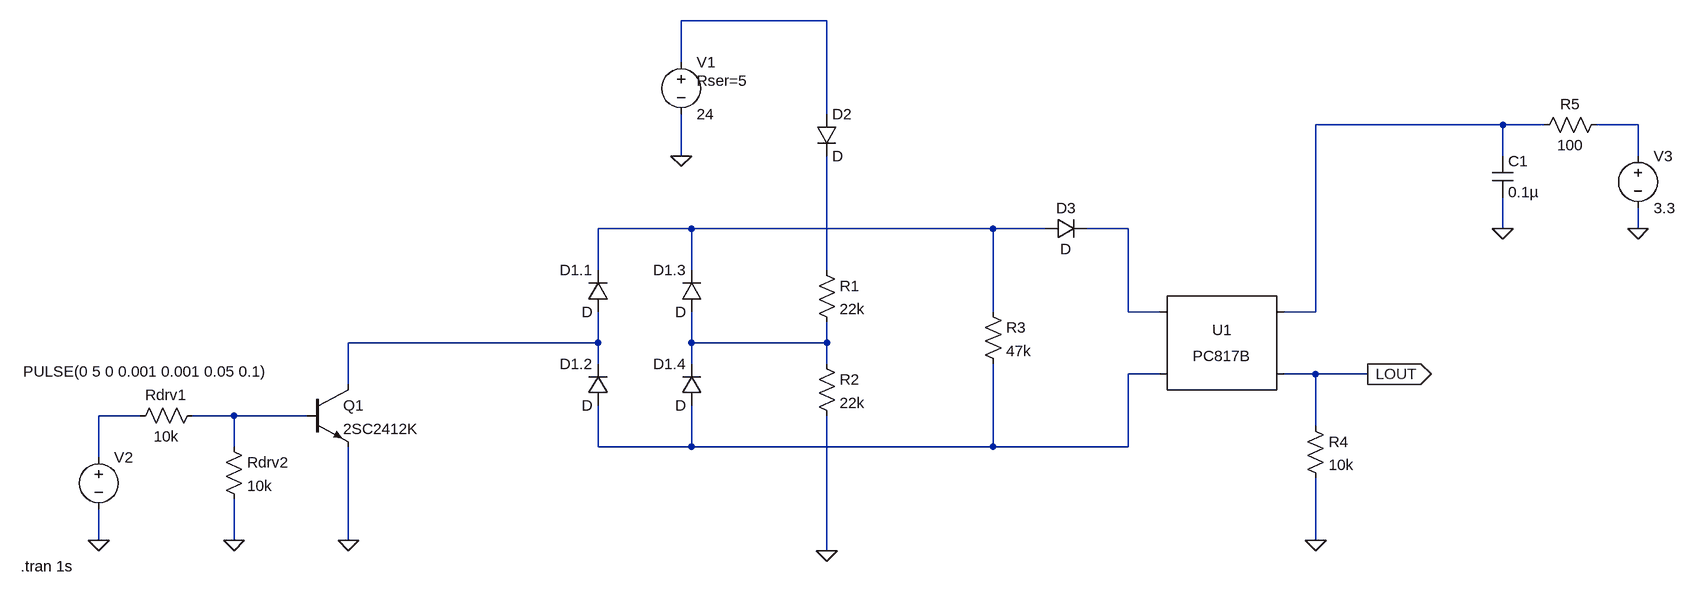
[diagram p0: schematic SensorIO.asc]
SensorIO.asc, the LTspice schematic file:
Version 4
SHEET 1 1640 680
WIRE 192 -304 -32 -304
WIRE -32 -240 -32 -304
WIRE 192 -160 192 -304
WIRE 1232 -144 944 -144
WIRE 1296 -144 1232 -144
WIRE 1440 -144 1376 -144
WIRE -32 -96 -32 -160
WIRE 1232 -96 1232 -144
WIRE 1440 -96 1440 -144
WIRE -16 16 -160 16
WIRE 448 16 -16 16
WIRE 528 16 448 16
WIRE 656 16 592 16
WIRE 1232 16 1232 -32
WIRE 1440 16 1440 -16
WIRE -160 80 -160 16
WIRE -16 80 -16 16
WIRE 192 80 192 -96
WIRE 448 144 448 16
WIRE 656 144 656 16
WIRE 704 144 656 144
WIRE 944 144 944 -144
WIRE 944 144 896 144
WIRE -160 192 -160 144
WIRE -160 192 -544 192
WIRE -16 192 -16 144
WIRE 192 192 192 160
WIRE 192 192 -16 192
WIRE -160 224 -160 192
WIRE -16 224 -16 192
WIRE 192 224 192 192
WIRE 704 240 656 240
WIRE 944 240 896 240
WIRE 1024 240 944 240
WIRE -544 256 -544 192
WIRE -864 304 -928 304
WIRE -720 304 -784 304
WIRE -608 304 -720 304
WIRE 944 320 944 240
WIRE -720 352 -720 304
WIRE -160 352 -160 288
WIRE -16 352 -16 288
WIRE -16 352 -160 352
WIRE 448 352 448 224
WIRE 448 352 -16 352
WIRE 656 352 656 240
WIRE 656 352 448 352
WIRE -928 368 -928 304
WIRE -928 496 -928 448
WIRE -720 496 -720 432
WIRE -544 496 -544 352
WIRE 944 496 944 400
WIRE 192 512 192 304
FLAG 192 512 0
FLAG -32 -96 0
FLAG -928 496 0
FLAG 1440 16 0
FLAG 944 496 0
FLAG -720 496 0
FLAG -544 496 0
FLAG 1232 16 0
FLAG 1024 240 LOUT
IOPIN 1024 240 Out
SYMBOL res 176 64 R0
SYMATTR InstName R1
SYMATTR Value 22k
SYMBOL res 176 208 R0
SYMATTR InstName R2
SYMATTR Value 22k
SYMBOL voltage -32 -256 R0
WINDOW 123 0 0 Left 0
WINDOW 39 24 44 Left 2
SYMATTR SpiceLine Rser=5
SYMATTR InstName V1
SYMATTR Value 24
SYMBOL diode 0 144 R180
WINDOW 0 24 64 Left 2
WINDOW 3 24 0 Left 2
SYMATTR InstName D1.3
SYMBOL diode 0 288 R180
WINDOW 0 24 64 Left 2
WINDOW 3 24 0 Left 2
SYMATTR InstName D1.4
SYMBOL diode -144 288 R180
WINDOW 0 24 64 Left 2
WINDOW 3 24 0 Left 2
SYMATTR InstName D1.2
SYMBOL diode -144 144 R180
WINDOW 0 24 64 Left 2
WINDOW 3 24 0 Left 2
SYMATTR InstName D1.1
SYMBOL diode 528 32 R270
WINDOW 0 32 32 VTop 2
WINDOW 3 0 32 VBottom 2
SYMATTR InstName D3
SYMBOL Optos\\PC817B 800 192 R0
SYMATTR InstName U1
SYMBOL res 432 128 R0
SYMATTR InstName R3
SYMATTR Value 47k
SYMBOL npn -608 256 R0
SYMATTR InstName Q1
SYMATTR Value 2SC2412K
SYMBOL res -736 336 R0
SYMATTR InstName Rdrv2
SYMATTR Value 10k
SYMBOL voltage -928 352 R0
WINDOW 3 -116 -116 Left 2
WINDOW 123 0 0 Left 0
WINDOW 39 0 0 Left 0
SYMATTR Value PULSE(0 5 0 0.001 0.001 0.05 0.1)
SYMATTR InstName V2
SYMBOL voltage 1440 -112 R0
WINDOW 123 0 0 Left 0
WINDOW 39 0 0 Left 0
SYMATTR InstName V3
SYMATTR Value 3.3
SYMBOL res 928 304 R0
SYMATTR InstName R4
SYMATTR Value 10k
SYMBOL res -768 288 R90
WINDOW 0 0 56 VBottom 2
WINDOW 3 32 56 VTop 2
SYMATTR InstName Rdrv1
SYMATTR Value 10k
SYMBOL diode 176 -160 R0
SYMATTR InstName D2
SYMBOL res 1392 -160 R90
WINDOW 0 0 56 VBottom 2
WINDOW 3 32 56 VTop 2
SYMATTR InstName R5
SYMATTR Value 100
SYMBOL cap 1216 -96 R0
SYMATTR InstName C1
SYMATTR Value 0.1µ
TEXT -1048 536 Left 2 !.tran 1s

The netlist it stands for:
* SensorIO.asc
R1 N006 N008 22k
R2 N008 0 22k
V1 N001 0 24 Rser=5
D1.3 N008 N004 D
D1.4 N009 N008 D
D1.2 N009 N007 D
D1.1 N007 N004 D
D3 N004 N005 D
XU1 N005 N009 N002 LOUT PC817 Igain=1.5m
R3 N004 N009 47k
Q1 N007 N011 0 0 2SC2412K
Rdrv2 N011 0 10k
V2 N010 0 PULSE(0 5 0 0.001 0.001 0.05 0.1)
V3 N003 0 3.3
R4 LOUT 0 10k
Rdrv1 N011 N010 10k
D2 N001 N006 D
R5 N003 N002 100
C1 N002 0 0.1µ
.model D D
.lib standard.dio
.model NPN NPN
.model PNP PNP
.lib standard.bjt
.tran 1s
.lib PC817.sub
.backanno
.end